# Altium schematic sheet Sheet1.SchDoc
size A2
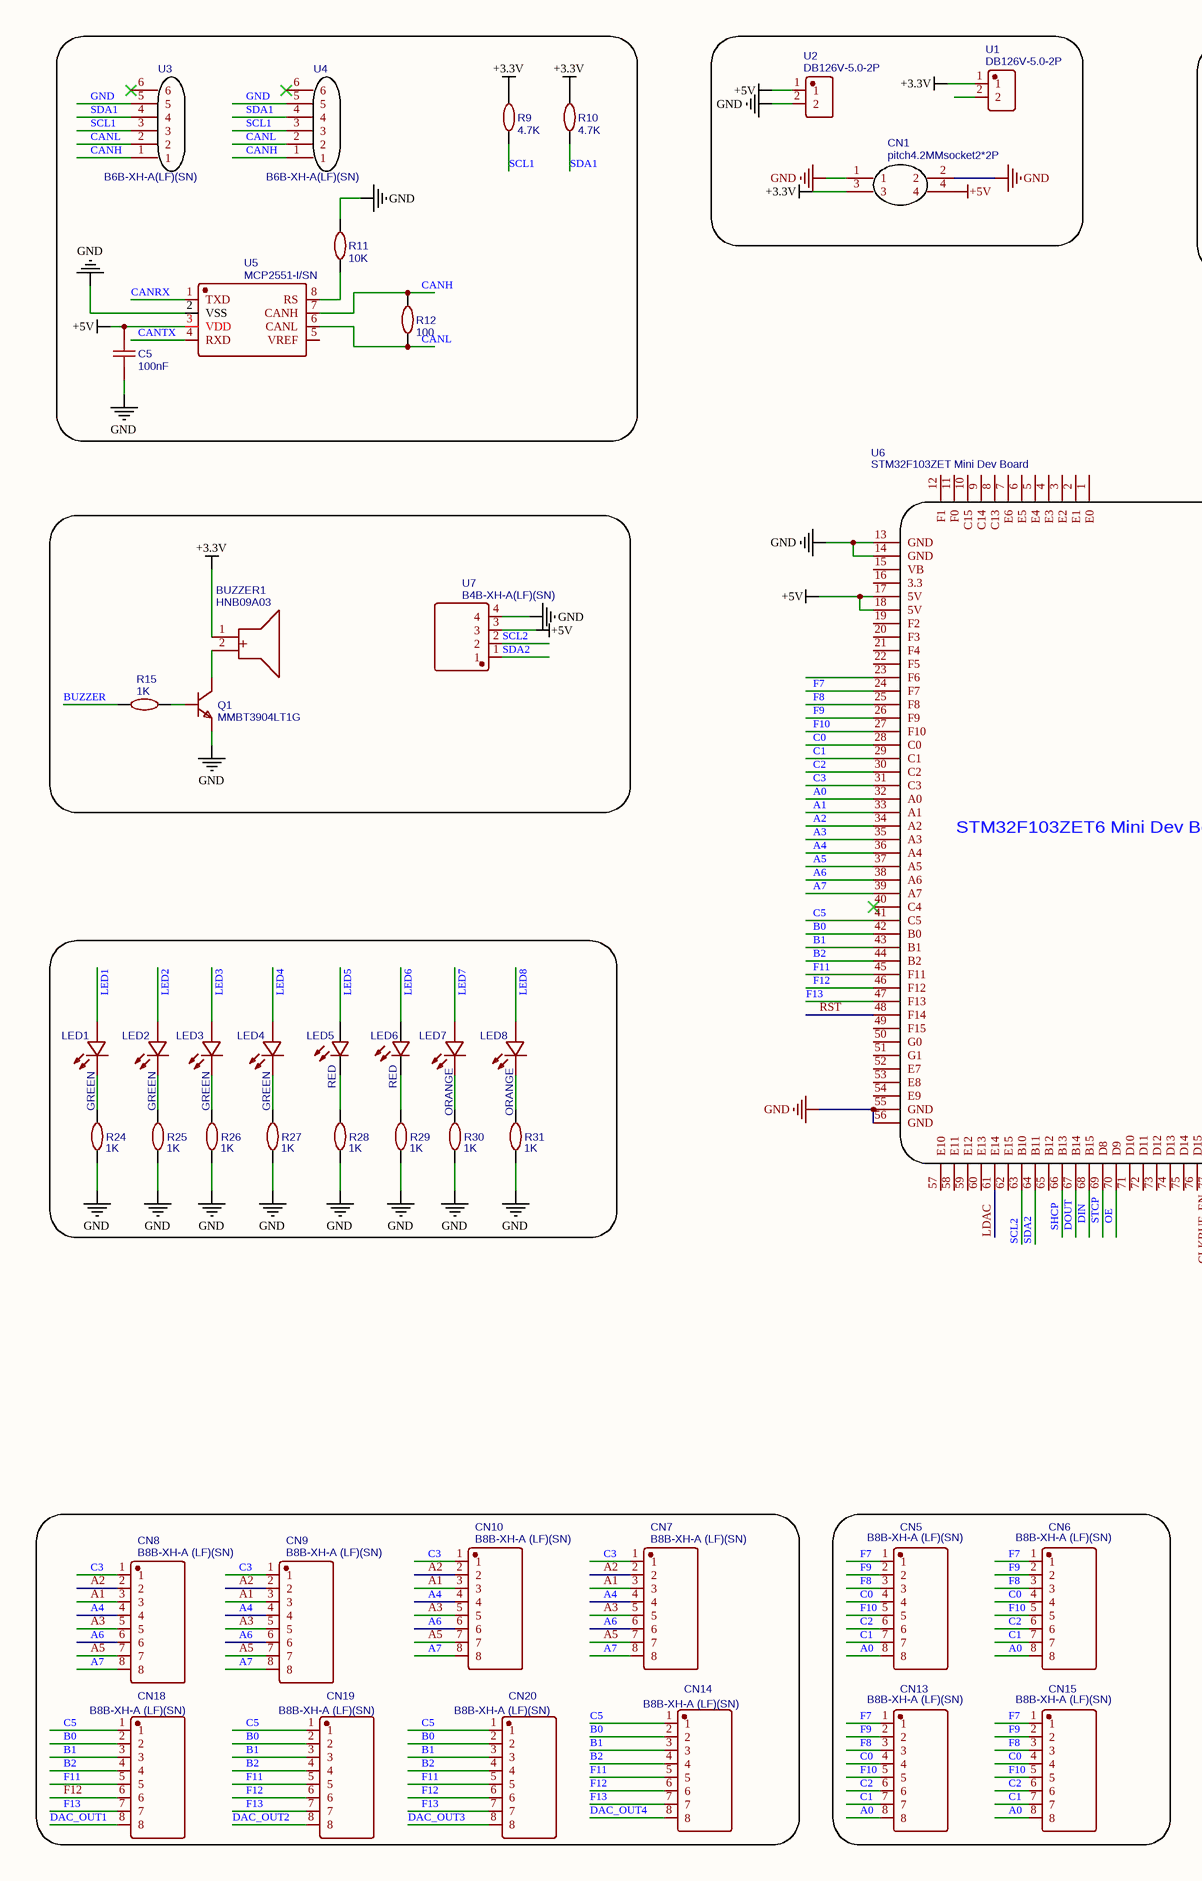
[diagram p0: Sheet1.SchDoc, left]
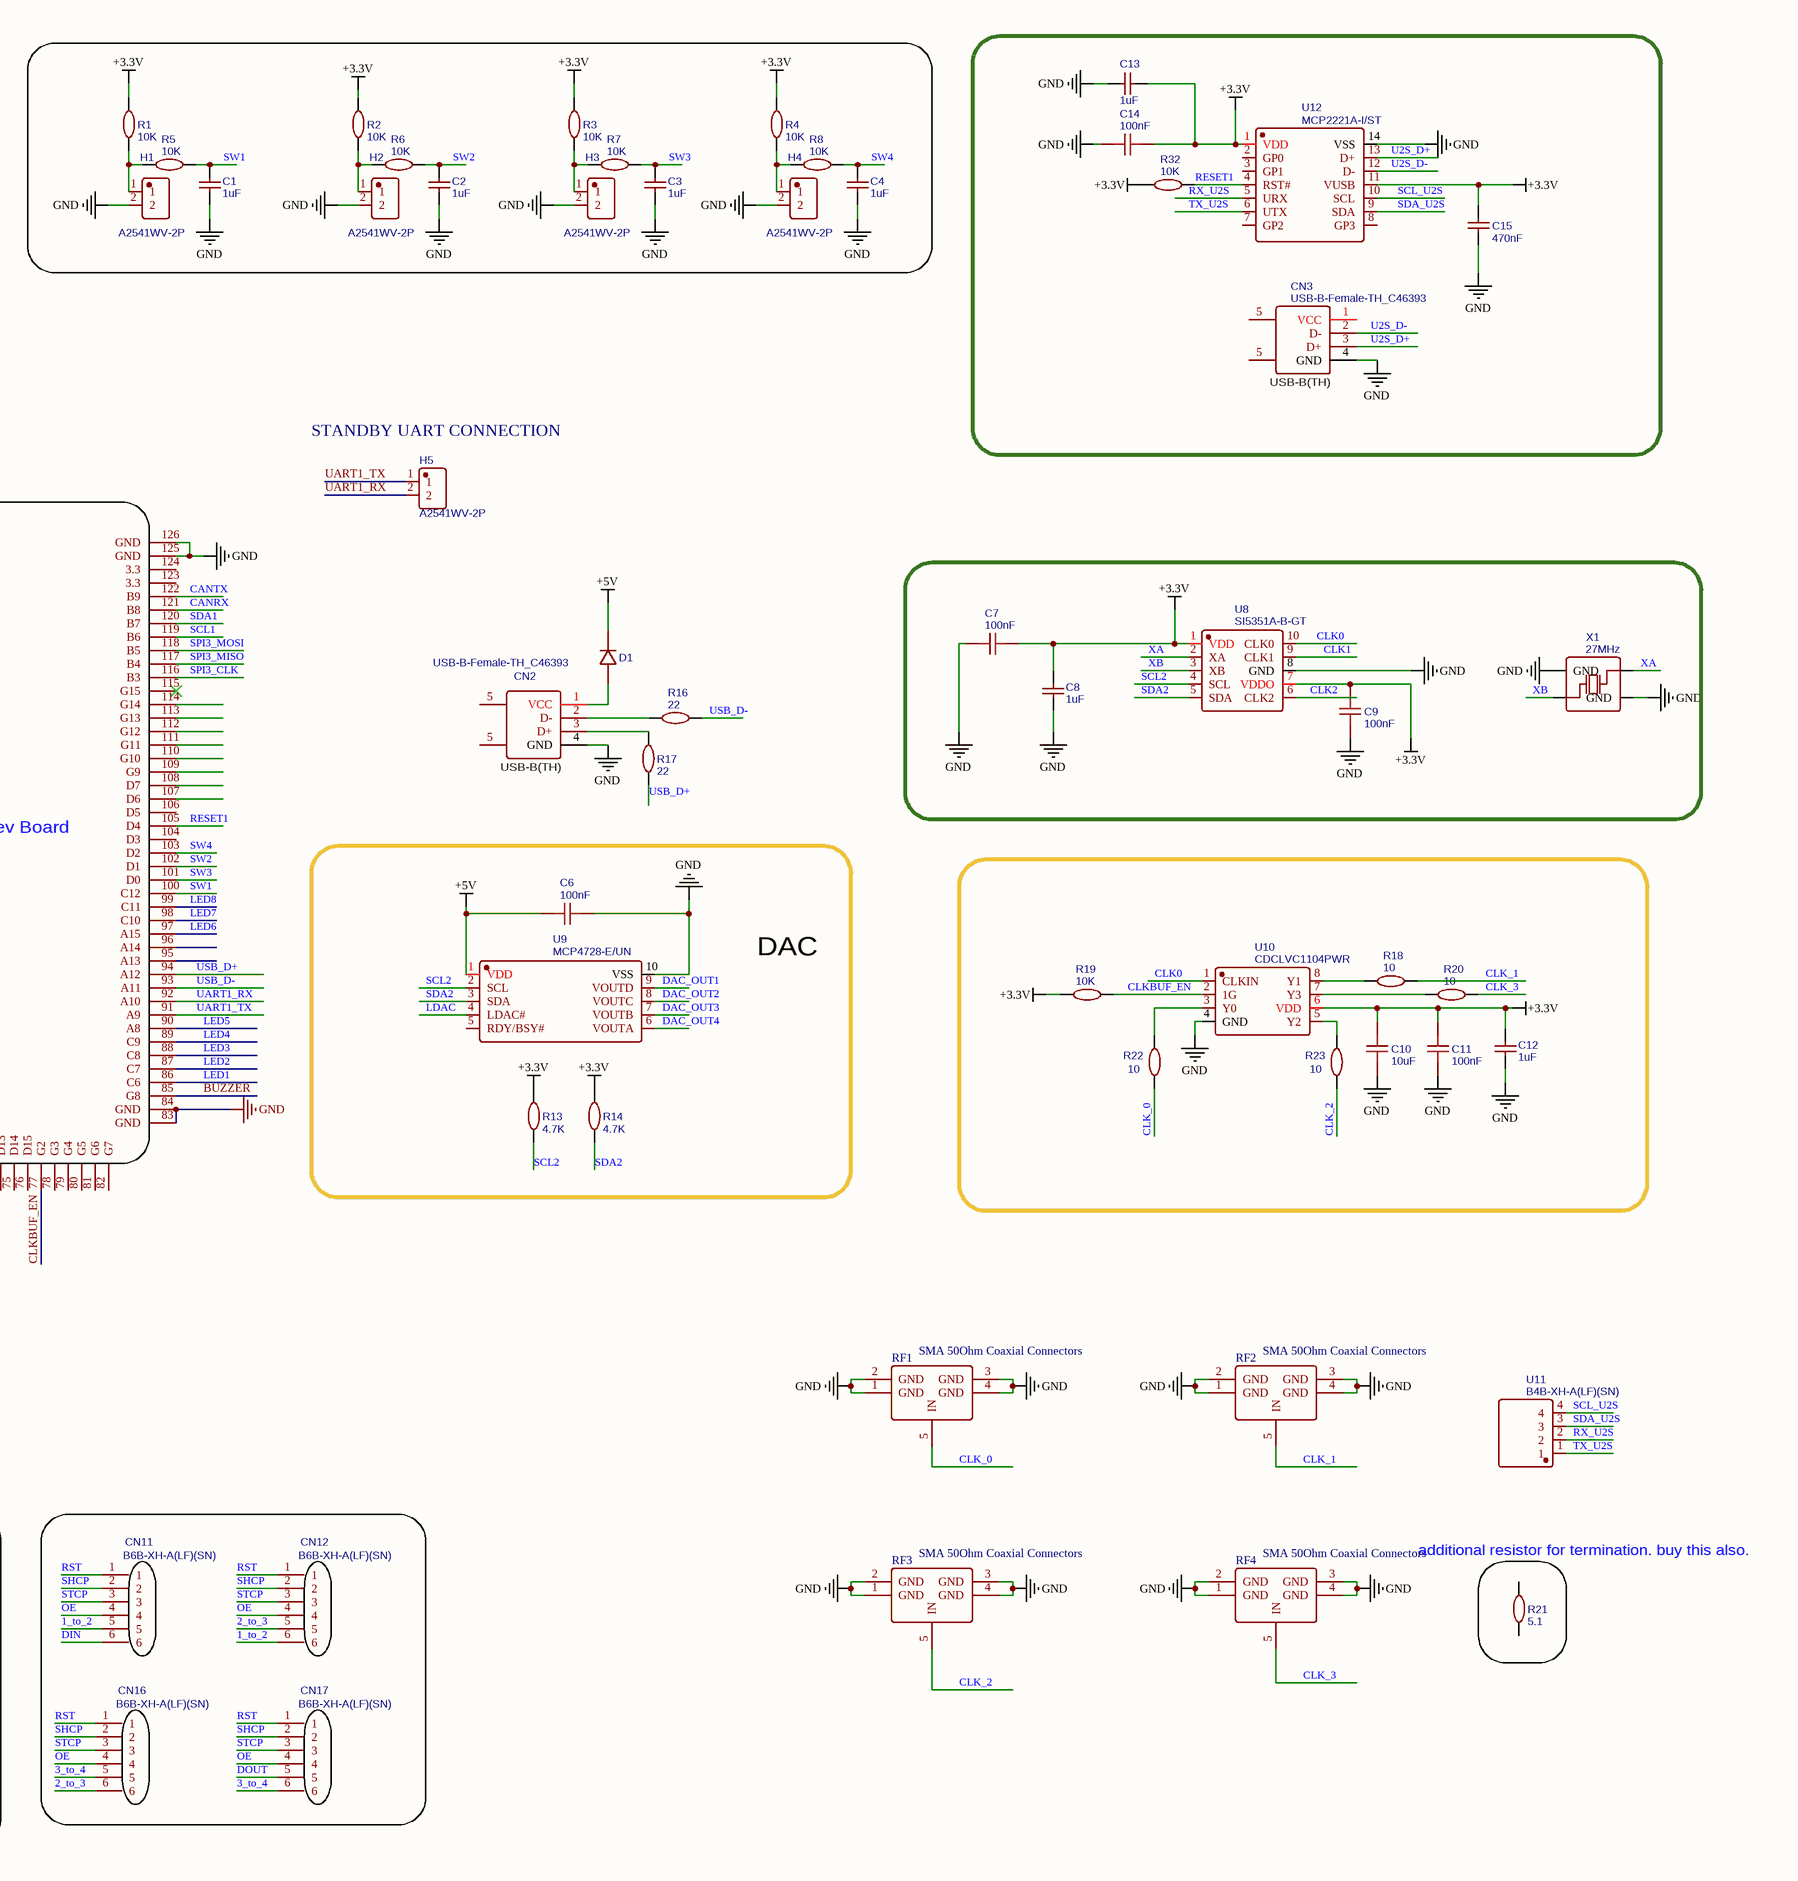
[diagram p1: Sheet1.SchDoc, right]

## Parts
BUZZER1  HNB09A03  [BUZ-TH_BD9.0-P5.00-D0.6-FD]
C1  1uF  [C0805]
C2  1uF  [C0805]
C3  1uF  [C0805]
C4  1uF  [C0805]
C5  100nF  [C0603]
C6  100nF  [C0603]
C7  100nF  [C0603]
C8  1uF  [C0805]
C9  100nF  [C0603]
C10  10uF  [C0805]
C11  100nF  [C0603]
C12  1uF  [C0805]
C13  1uF  [C0805]
C14  100nF  [C0603]
C15  470nF  [C0603]
CN1  pitch4.2MMsocket2*2P  [CONN-TH_HAA420A-4A]
CN2  USB-B-Female-TH_C46393  [USB-B_TH_BF90]
CN3  USB-B-Female-TH_C46393  [USB-B_TH_BF90]
CN5  B8B-XH-A (LF)(SN)  [CONN-TH_B8B-XH-A (LF)(SN)]
CN6  B8B-XH-A (LF)(SN)  [CONN-TH_B8B-XH-A (LF)(SN)]
CN7  B8B-XH-A (LF)(SN)  [CONN-TH_B8B-XH-A (LF)(SN)]
CN8  B8B-XH-A (LF)(SN)  [CONN-TH_B8B-XH-A (LF)(SN)]
CN9  B8B-XH-A (LF)(SN)  [CONN-TH_B8B-XH-A (LF)(SN)]
CN10  B8B-XH-A (LF)(SN)  [CONN-TH_B8B-XH-A (LF)(SN)]
CN11  B6B-XH-A(LF)(SN)  [CONN-TH_6P-P2.50_B6B-XH-A(LF)(SN)]
CN12  B6B-XH-A(LF)(SN)  [CONN-TH_6P-P2.50_B6B-XH-A(LF)(SN)]
CN13  B8B-XH-A (LF)(SN)  [CONN-TH_B8B-XH-A (LF)(SN)]
CN14  B8B-XH-A (LF)(SN)  [CONN-TH_B8B-XH-A (LF)(SN)]
CN15  B8B-XH-A (LF)(SN)  [CONN-TH_B8B-XH-A (LF)(SN)]
CN16  B6B-XH-A(LF)(SN)  [CONN-TH_6P-P2.50_B6B-XH-A(LF)(SN)]
CN17  B6B-XH-A(LF)(SN)  [CONN-TH_6P-P2.50_B6B-XH-A(LF)(SN)]
CN18  B8B-XH-A (LF)(SN)  [CONN-TH_B8B-XH-A (LF)(SN)]
CN19  B8B-XH-A (LF)(SN)  [CONN-TH_B8B-XH-A (LF)(SN)]
CN20  B8B-XH-A (LF)(SN)  [CONN-TH_B8B-XH-A (LF)(SN)]
D1  CUS08F30,H3F  [SOD-323F_L2.0-W1.6-LS2.5-RD]  (value not drawn)
H1  A2541WV-2P  [HDR-TH_P2.54-H-M_A2541WV-2P]
H2  A2541WV-2P  [HDR-TH_P2.54-H-M_A2541WV-2P]
H3  A2541WV-2P  [HDR-TH_P2.54-H-M_A2541WV-2P]
H4  A2541WV-2P  [HDR-TH_P2.54-H-M_A2541WV-2P]
H5  A2541WV-2P  [HDR-TH_P2.54-H-M_A2541WV-2P]
LED1  GREEN  [LED0603-R-RD]
LED2  GREEN  [LED0603-R-RD]
LED3  GREEN  [LED0603-R-RD]
LED4  GREEN  [LED0603-R-RD]
LED5  RED  [LED0603-R-RD]
LED6  RED  [LED0603-R-RD]
LED7  ORANGE  [LED0603-R-RD]
LED8  ORANGE  [LED0603-R-RD]
Q1  MMBT3904LT1G  [SOT-23-3_L2.9-W1.6-P1.90-LS2.8-BR]
R1  10K  [R0603]
R2  10K  [R0603]
R3  10K  [R0603]
R4  10K  [R0603]
R5  10K  [R0603]
R6  10K  [R0603]
R7  10K  [R0603]
R8  10K  [R0603]
R9  4.7K  [R0603]
R10  4.7K  [R0603]
R11  10K  [R0603]
R12  100  [R0603]
R13  4.7K  [R0603]
R14  4.7K  [R0603]
R15  1K  [R0603]
R16  22  [R0603]
R17  22  [R0603]
R18  10  [R0603]
R19  10K  [R0603]
R20  10  [R0603]
R21  5.1  [R0603]
R22  10  [R0603]
R23  10  [R0603]
R24  1K  [R0603]
R25  1K  [R0603]
R26  1K  [R0603]
R27  1K  [R0603]
R28  1K  [R0603]
R29  1K  [R0603]
R30  1K  [R0603]
R31  1K  [R0603]
R32  10K  [R0603]
RF1  SMA 50Ohm Coaxial Connectors  [BWSMA-KE-Z001]
RF2  SMA 50Ohm Coaxial Connectors  [BWSMA-KE-Z001]
RF3  SMA 50Ohm Coaxial Connectors  [BWSMA-KE-Z001]
RF4  SMA 50Ohm Coaxial Connectors  [BWSMA-KE-Z001]
U1  DB126V-5.0-2P  [CONN-TH_2P-P5.00_L7.8-W10.0]
U2  DB126V-5.0-2P  [CONN-TH_2P-P5.00_L7.8-W10.0]
U3  B6B-XH-A(LF)(SN)  [CONN-TH_6P-P2.50_B6B-XH-A(LF)(SN)]
U4  B6B-XH-A(LF)(SN)  [CONN-TH_6P-P2.50_B6B-XH-A(LF)(SN)]
U5  MCP2551-I/SN  [SOIC-8_L4.9-W3.9-P1.27-LS6.0-BL]
U6  STM32F103ZET Mini Dev Board  [STM32F103ZET MINI DEV BOARD]
U7  B4B-XH-A(LF)(SN)  [CONN-TH_B4B-XH-A (LF)(SN)]
U8  SI5351A-B-GT  [MSOP-10_L3.0-W3.0-P0.50-LS5.0-BL]
U9  MCP4728-E/UN  [MSOP-10_L3.0-W3.0-P0.50-LS5.0-TL]
U10  CDCLVC1104PWR  [TSSOP-8_L4.4-W3.0-P0.65-LS6.4-BL]
U11  B4B-XH-A(LF)(SN)  [CONN-TH_B4B-XH-A (LF)(SN)]
U12  MCP2221A-I/ST  [TSSOP-14_L5.0-W4.4-P0.65-LS6.4-BL]
X1  27MHz  [OSC-SMD_4P-L2.5-W2.0-BL]

## Blocks framed on the sheet
DAC: C6 R13 R14 U9

## Nets
+3.3V: BUZZER1.1(+) C7.2 C8.2 C9.2 C10.2 C11.2 C12.2 C13.1 C14.2 C15.2 CN1.3 R1.2 R2.2 R3.2 R4.2 R9.2 R10.2 R13.2 R14.2 R19.2 R32.1 U1.1 U8.1(VDD) U8.7(VDDO) U10.6(VDD) U12.1(VDD) U12.11(VUSB)
+5V: C5.2 C6.1 CN1.4 D1.1(C) U2.1 U5.3(VDD) U6.17(5V) U6.18(5V) U7.3 U9.1(VDD)
GND: C1.1 C2.1 C3.1 C4.1 C5.1 C6.2 C7.1 C8.1 C9.1 C10.1 C11.1 C12.1 C13.2 C14.1 C15.1 CN1.1 CN1.2 CN2.4(GND) CN3.4(GND) H1.2 H2.2 H3.2 H4.2 Q1.2 R11.2 R24.2 R25.2 R26.2 R27.2 R28.2 R29.2 R30.2 R31.2 RF1.1(GND) RF1.2(GND) RF1.3(GND) RF1.4(GND) RF2.1(GND) RF2.2(GND) RF2.3(GND) RF2.4(GND) RF3.1(GND) RF3.2(GND) RF3.3(GND) RF3.4(GND) RF4.1(GND) RF4.2(GND) RF4.3(GND) RF4.4(GND) U2.2 U3.5 U4.5 U5.2(VSS) U6.13(GND) U6.14(GND) U6.55(GND) U6.56(GND) U6.83(GND) U6.84(GND) U6.125(GND) U6.126(GND) U7.4 U8.8(GND) U9.10(VSS) U10.4(GND) U12.14(VSS) X1.2(GND) X1.4(GND)
1_to_2: CN11.5 CN12.6
2_to_3: CN12.5 CN16.6
3_to_4: CN16.5 CN17.6
A0: CN5.8 CN6.8 CN13.8 CN15.8 U6.32(A0)
A1: CN7.3 CN8.3 CN9.3 CN10.3 U6.33(A1)
A2: CN7.2 CN8.2 CN9.2 CN10.2 U6.34(A2)
A3: CN7.5 CN8.5 CN9.5 CN10.5 U6.35(A3)
A4: CN7.4 CN8.4 CN9.4 CN10.4 U6.36(A4)
A5: CN7.7 CN8.7 CN9.7 CN10.7 U6.37(A5)
A6: CN7.6 CN8.6 CN9.6 CN10.6 U6.38(A6)
A7: CN7.8 CN8.8 CN9.8 CN10.8 U6.39(A7)
B0: CN14.2 CN18.2 CN19.2 CN20.2 U6.42(B0)
B1: CN14.3 CN18.3 CN19.3 CN20.3 U6.43(B1)
B2: CN14.4 CN18.4 CN19.4 CN20.4 U6.44(B2)
BUZZER: R15.1 U6.85(G8)
C0: CN5.4 CN6.4 CN13.4 CN15.4 U6.28(C0)
C1: CN5.7 CN6.7 CN13.7 CN15.7 U6.29(C1)
C2: CN5.6 CN6.6 CN13.6 CN15.6 U6.30(C2)
C3: CN7.1 CN8.1 CN9.1 CN10.1 U6.31(C3)
C5: CN14.1 CN18.1 CN19.1 CN20.1 U6.41(C5)
CANH: R12.2 U3.1 U4.1 U5.7(CANH)
CANL: R12.1 U3.2 U4.2 U5.6(CANL)
CANRX: U5.1(TXD) U6.121(B8)
CANTX: U5.4(RXD) U6.122(B9)
CLK0: U8.10(CLK0) U10.1(CLKIN)
CLK1: U8.9(CLK1)
CLK2: U8.6(CLK2)
CLK_0: R22.2 RF1.5(IN)
CLK_1: R18.2 RF2.5(IN)
CLK_2: R23.1 RF3.5(IN)
CLK_3: R20.2 RF4.5(IN)
CLKBUF_EN: R19.1 U6.77(G2) U10.2(1G)
DAC_OUT1: CN18.8 U9.9(VOUTD)
DAC_OUT2: CN19.8 U9.8(VOUTC)
DAC_OUT3: CN20.8 U9.7(VOUTB)
DAC_OUT4: CN14.8 U9.6(VOUTA)
DIN: CN11.6 U6.68(B15)
DOUT: CN17.5 U6.67(B14)
F7: CN5.1 CN6.1 CN13.1 CN15.1 U6.24(F7)
F8: CN5.3 CN6.3 CN13.3 CN15.3 U6.25(F8)
F9: CN5.2 CN6.2 CN13.2 CN15.2 U6.26(F9)
F10: CN5.5 CN6.5 CN13.5 CN15.5 U6.27(F10)
F11: CN14.5 CN18.5 CN19.5 CN20.5 U6.45(F11)
F12: CN14.6 CN18.6 CN19.6 CN20.6 U6.46(F12)
F13: CN14.7 CN18.7 CN19.7 CN20.7 U6.47(F13)
LDAC: U6.61(E14) U9.4(LDAC#)
LED1: LED1.1(A) U6.86(C6)
LED2: LED2.1(A) U6.87(C7)
LED3: LED3.1(A) U6.88(C8)
LED4: LED4.1(A) U6.89(C9)
LED5: LED5.1(A) U6.90(A8)
LED6: LED6.1(A) U6.97(A15)
LED7: LED7.1(A) U6.98(C10)
LED8: LED8.1(A) U6.99(C11)
OE: CN11.4 CN12.4 CN16.4 CN17.4 U6.70(D9)
RESET1: R32.2 U6.105(D4) U12.4(RST#)
RST: CN11.1 CN12.1 CN16.1 CN17.1 U6.48(F14)
RX_U2S: U11.2 U12.5(URX)
SCL1: R9.1 U3.3 U4.3 U6.119(B6)
SCL2: R13.1 U6.63(B10) U7.2 U8.4(SCL) U9.2(SCL)
SCL_U2S: U11.4 U12.10(SCL)
SDA1: R10.1 U3.4 U4.4 U6.120(B7)
SDA2: R14.1 U6.64(B11) U7.1 U8.5(SDA) U9.3(SDA)
SDA_U2S: U11.3 U12.9(SDA)
SHCP: CN11.2 CN12.2 CN16.2 CN17.2 U6.66(B13)
SPI3_CLK: U6.116(B3)
SPI3_MISO: U6.117(B4)
SPI3_MOSI: U6.118(B5)
STCP: CN11.3 CN12.3 CN16.3 CN17.3 U6.69(D8)
SW1: C1.2 R5.1 U6.100(C12)
SW2: C2.2 R6.1 U6.102(D1)
SW3: C3.2 R7.1 U6.101(D0)
SW4: C4.2 R8.1 U6.103(D2)
TX_U2S: U11.1 U12.6(UTX)
U2S_D+: CN3.3(D+) U12.13(D+)
U2S_D-: CN3.2(D-) U12.12(D-)
UART1_RX: H5.2 U6.92(A10)
UART1_TX: H5.1 U6.91(A9)
USB_D+: R17.1 U6.94(A12)
USB_D-: R16.2 U6.93(A11)
XA: U8.2(XA) X1.3(OSC2)
XB: U8.3(XB) X1.1(OSC1)
NetBUZZER1_2: BUZZER1.2(-) Q1.3
NetCN2_1: CN2.1(VCC) D1.2(A)
NetCN2_2: CN2.2(D-) R16.1
NetCN2_3: CN2.3(D+) R17.2
NetH1_1: H1.1 R1.1 R5.2
NetH2_1: H2.1 R2.1 R6.2
NetH3_1: H3.1 R3.1 R7.2
NetH4_1: H4.1 R4.1 R8.2
NetLED1_2: LED1.2(K) R24.1
NetLED2_2: LED2.2(K) R25.1
NetLED3_2: LED3.2(K) R26.1
NetLED4_2: LED4.2(K) R27.1
NetLED5_2: LED5.2(C) R28.1
NetLED6_2: LED6.2(C) R29.1
NetLED7_2: LED7.2(K) R30.1
NetLED8_2: LED8.2(K) R31.1
NetQ1_1: Q1.1 R15.2
NetR11_1: R11.1 U5.8(RS)
NetR18_1: R18.1 U10.8(Y1)
NetR20_1: R20.1 U10.7(Y3)
NetR22_1: R22.1 U10.3(Y0)
NetR23_2: R23.2 U10.5(Y2)

Not connected (* = marked no-connect by the designer): CN2 5(EH); CN3 1(VCC) 5(EH); R21 1 2; U1 2; U3 6*; U4 6*; U5 5(VREF); U6 1(E0) 2(E1) 3(E2) 4(E3) 5(E4) 6(E5) 7(E6) 8(C13) 9(C14) 10(C15) 11(F0) 12(F1) 15(VB) 16(3.3) 19(F2) 20(F3) 21(F4) 22(F5) 23(F6) 40(C4)* 49(F15) 50(G0) 51(G1) 52(E7) 53(E8) 54(E9) 57(E10) 58(E11) 59(E12) 60(E13) 62(E15) 65(B12) 71(D10) 72(D11) 73(D12) 74(D13) 75(D14) 76(D15) 78(G3) 79(G4) 80(G5) 81(G6) 82(G7) 95(A13) 96(A14) 104(D3) 106(D5) 107(D6) 108(D7) 109(G9) 110(G10) 111(G11) 112(G12) 113(G13) 114(G14) 115(G15)* 123(3.3) 124(3.3); U9 5(RDY/BSY#); U12 2(GP0) 3(GP1) 7(GP2) 8(GP3)

## Notes on the sheet
- (near H5) STANDBY UART CONNECTION
- (near R21) additional resistor for termination. buy this also.
- (in symbol STM32F103ZET Mini Dev Board) STM32F103ZET6 Mini Dev Board
- (in symbol USB-B-Female-TH_C46393) USB-B(TH)

## Library data of the parts
BUZZER1 = HNB09A03: Manufacturer: Jiangsu Huaneng Elec; Contributor: LCSC; spicePre: B; spiceSymbolName: HNB09A03; Supplier: LCSC; Supplier Part Number: C96102; Manufacture Part Number: HNB09A03
C1-C4 C8 C12 C13 = 1uF: Manufacture Part Number: CL10A105KP8NNNC; Manufacturer: SAMSUNG; nameAlias: Capacitance; spicePre: C; spiceSymbolName: CL10A105KP8NNNC; Supplier: LCSC; Supplier Part Number: C26413
C5-C7 C9 C11 C14 = 100nF: Manufacturer: YAGEO; Manufacture Part Number: CC0603KRX7R9BB104; nameAlias: Capacitance; SMT Type: Basic; BOM_LCSC Assembly: Yes; spicePre: C; spiceSymbolName: CC0603KRX7R9BB104; Supplier: LCSC; Supplier Part Number: C14663
C10 = 10uF: Manufacturer: SAMSUNG; Manufacture Part Number: CL21B106KOQNNNE; nameAlias: Capacitance; spicePre: C; spiceSymbolName: CL21B106KOQNNNE; Supplier: LCSC; Supplier Part Number: C95841
C15 = 470nF: Manufacturer: WTC; Manufacture Part Number: 0603B474K100; nameAlias: Capacitance; Contributor: LCSC; spicePre: C; spiceSymbolName: 0603B474K100; Supplier: LCSC; Supplier Part Number: C123513
CN1 = pitch4.2MMsocket2*2P: Manufacturer: BOOMELE; image: //image.lceda.cn/szlcsc/C24697.jpg; spicePre: C; spiceSymbolName: pitch4.2MMsocket2*2P; Supplier: LCSC; Manufacture Part Number: pitch4.2MMsocket2*2P; Supplier Part Number: C24697
CN2 CN3 = USB-B-Female-TH_C46393: Manufacture Part Number: C46393; Manufacturer: Jing Extension of the Electronic Co.; image: //image.lceda.cn/szlcsc/C46393.jpg; spicePre: C; spiceSymbolName: USB-B-Female-TH_C46393; Supplier: LCSC; Supplier Part Number: C46393
CN5-CN10 CN13-CN15 CN18-CN20 = B8B-XH-A (LF)(SN): Manufacturer: JST Sales America; Contributor: LCSC; spicePre: C; spiceSymbolName: B8B-XH-A (LF)(SN); Supplier: LCSC; Supplier Part Number: C157972; Manufacture Part Number: B8B-XH-A (LF)(SN)
CN11 CN12 CN16 CN17 U3 U4 = B6B-XH-A(LF)(SN): Manufacturer: JST Sales America; Contributor: LCSC; spicePre: U; spiceSymbolName: B6B-XH-A(LF)(SN); Supplier: LCSC; Supplier Part Number: C144397; Manufacture Part Number: B6B-XH-A(LF)(SN)
D1 = CUS08F30,H3F: Manufacturer: TOSHIBA; Contributor: LCSC; SMT Type: Extend; BOM_LCSC Assembly: Yes; spicePre: D; spiceSymbolName: CUS08F30,H3F; Supplier Part Number: C150183; Supplier: LCSC; Manufacture Part Number: CUS08F30,H3F
H1-H5 = A2541WV-2P: Manufacturer: CJT(Changjiang Connectors); Contributor: LCSC; spicePre: H; spiceSymbolName: A2541WV-2P; Supplier: LCSC; Supplier Part Number: C225477; Manufacture Part Number: A2541WV-2P
LED1-LED4 = GREEN: Manufacturer: Orient; Manufacture Part Number: ORH-G36G; Contributor: LCSC; SMT Type: Extend; BOM_LCSC Assembly: Yes; spicePre: L; spiceSymbolName: ORH-G36G; Supplier: LCSC; Supplier Part Number: C205443
LED5 LED6 = RED: Manufacturer: EVERLIGHT; Manufacture Part Number: 19-217/R6C-AL1M2VY/3T; SMT Type: Extend; image: //image.lceda.cn/szlcsc/C72044.jpg; BOM_LCSC Assembly: Yes; spicePre: L; spiceSymbolName: 19-217/R6C-AL1M2VY/3T; Supplier: LCSC; Supplier Part Number: C72044
LED7 LED8 = ORANGE: Manufacturer: Orient; Manufacture Part Number: ORH-R36A(0.6T); Contributor: LCSC; SMT Type: Extend; BOM_LCSC Assembly: Yes; spicePre: L; spiceSymbolName: ORH-R36A(0.6T); Supplier: LCSC; Supplier Part Number: C205445
Q1 = MMBT3904LT1G: Manufacturer: ON; SMT Type: Extend; BOM_LCSC Assembly: Yes; spicePre: Q; spiceSymbolName: MMBT3904LT1G; Supplier: LCSC; Manufacture Part Number: MMBT3904LT1G; Supplier Part Number: C81464
R1-R8 R11 R19 R32 = 10K: Manufacturer: YAGEO; Manufacture Part Number: RC0603FR-0710KL; nameAlias: Resistance (Ohms); spicePre: R; spiceSymbolName: RC0603FR-0710KL; Supplier: LCSC; Supplier Part Number: C98220
R9 R10 R13 R14 = 4.7K: Manufacturer: YAGEO; Manufacture Part Number: RC0603FR-074K7L; nameAlias: Resistance (Ohms); spicePre: R; spiceSymbolName: RC0603FR-074K7L; Supplier: LCSC; Supplier Part Number: C99782
R12 = 100: Manufacturer: UniOhm; Manufacture Part Number: 0603WAF1000T5E; nameAlias: Resistance (Ohms); SMT Type: Basic; BOM_LCSC Assembly: Yes; spicePre: R; spiceSymbolName: 0603WAF1000T5E; Supplier: LCSC; Supplier Part Number: C22775
R15 R24-R31 = 1K: Manufacture Part Number: RC0603FR-071KL; Manufacturer: YAGEO; nameAlias: Resistance (Ohms); spicePre: R; spiceSymbolName: RC0603FR-071KL; Supplier: LCSC; Supplier Part Number: C22548
R16 R17 = 22: Manufacturer: UniOhm; Manufacture Part Number: 0603WAJ0220T5E; nameAlias: Resistance (Ohms); spicePre: R; spiceSymbolName: 0603WAJ0220T5E; Supplier: LCSC; Supplier Part Number: C1203
R18 R20 R22 R23 = 10: Manufacturer: YAGEO; Manufacture Part Number: RC0603FR-0710RL; nameAlias: Resistance (Ohms); spicePre: R; spiceSymbolName: RC0603FR-0710RL; Supplier: LCSC; Supplier Part Number: C109318
R21 = 5.1: Manufacturer: UniOhm; Manufacture Part Number: 0603WAF510KT5E; nameAlias: Resistance (Ohms); SMT Type: Basic; BOM_LCSC Assembly: Yes; spicePre: R; spiceSymbolName: 0603WAF510KT5E; Supplier: LCSC; Supplier Part Number: C25197
RF1-RF4 = BWSMA-KE-Z001: Manufacturer: BAT WIRELESS; Supplier: LCSC; Supplier Part Number: C496549; Manufacture Part Number: BWSMA-KE-Z001
U1 U2 = DB126V-5.0-2P: Manufacturer: DIBO; Contributor: LCSC; spicePre: U; spiceSymbolName: DB126V-5.0-2P; Supplier: LCSC; Supplier Part Number: C395849; Manufacture Part Number: DB126V-5.0-2P
U5 = MCP2551-I/SN: Manufacturer: MICROCHIP; SMT Type: Extend; image: //image.lceda.cn/szlcsc/C7376.jpg; BOM_LCSC Assembly: Yes; spicePre: U; spiceSymbolName: MCP2551-I/SN; Supplier: LCSC; Manufacture Part Number: MCP2551-I/SN; Supplier Part Number: C7376
U6 = STM32F103ZET Mini Dev Board: Contributor: FYP_Squad; spicePre: U; spiceSymbolName: STM32F103ZET Mini Dev Board
U7 U11 = B4B-XH-A(LF)(SN): Manufacturer: JST Sales America; Contributor: LCSC; spicePre: U; spiceSymbolName: B4B-XH-A(LF)(SN); Supplier: LCSC; Supplier Part Number: C144395; Manufacture Part Number: B4B-XH-A(LF)(SN)
U8 = SI5351A-B-GT: Manufacturer: SILICON LABS; Contributor: LCSC; spicePre: U; spiceSymbolName: SI5351A-B-GT; Supplier: LCSC; Supplier Part Number: C529366; Manufacture Part Number: SI5351A-B-GT
U9 = MCP4728-E/UN: Manufacturer: Microchip Tech; Contributor: LCSC; SMT Type: Extend; BOM_LCSC Assembly: Yes; spicePre: U; spiceSymbolName: MCP4728-E/UN; Supplier: LCSC; Supplier Part Number: C108207; Manufacture Part Number: MCP4728-E/UN
U10 = CDCLVC1104PWR: Manufacturer: Texas Instruments; Contributor: LCSC; SMT Type: Extend; BOM_LCSC Assembly: Yes; spicePre: U; spiceSymbolName: CDCLVC1104PWR; Supplier: LCSC; Supplier Part Number: C485518; Manufacture Part Number: CDCLVC1104PWR
U12 = MCP2221A-I/ST: Manufacturer: MICROCHIP; Contributor: LCSC; SMT Type: Extend; BOM_LCSC Assembly: Yes; spicePre: U; spiceSymbolName: MCP2221A-I/ST; Supplier: LCSC; Manufacture Part Number: MCP2221A-I/ST; Supplier Part Number: C130462
X1 = 27MHz: Manufacturer: Seiko Epson; Manufacture Part Number: Q24FA20H00238; nameAlias: Frequency; Contributor: LCSC; spicePre: X; spiceSymbolName: Q24FA20H00238; Supplier: LCSC; Supplier Part Number: C255960